# EAGLE design xBeeMSP (EAGLE 9.2.2)
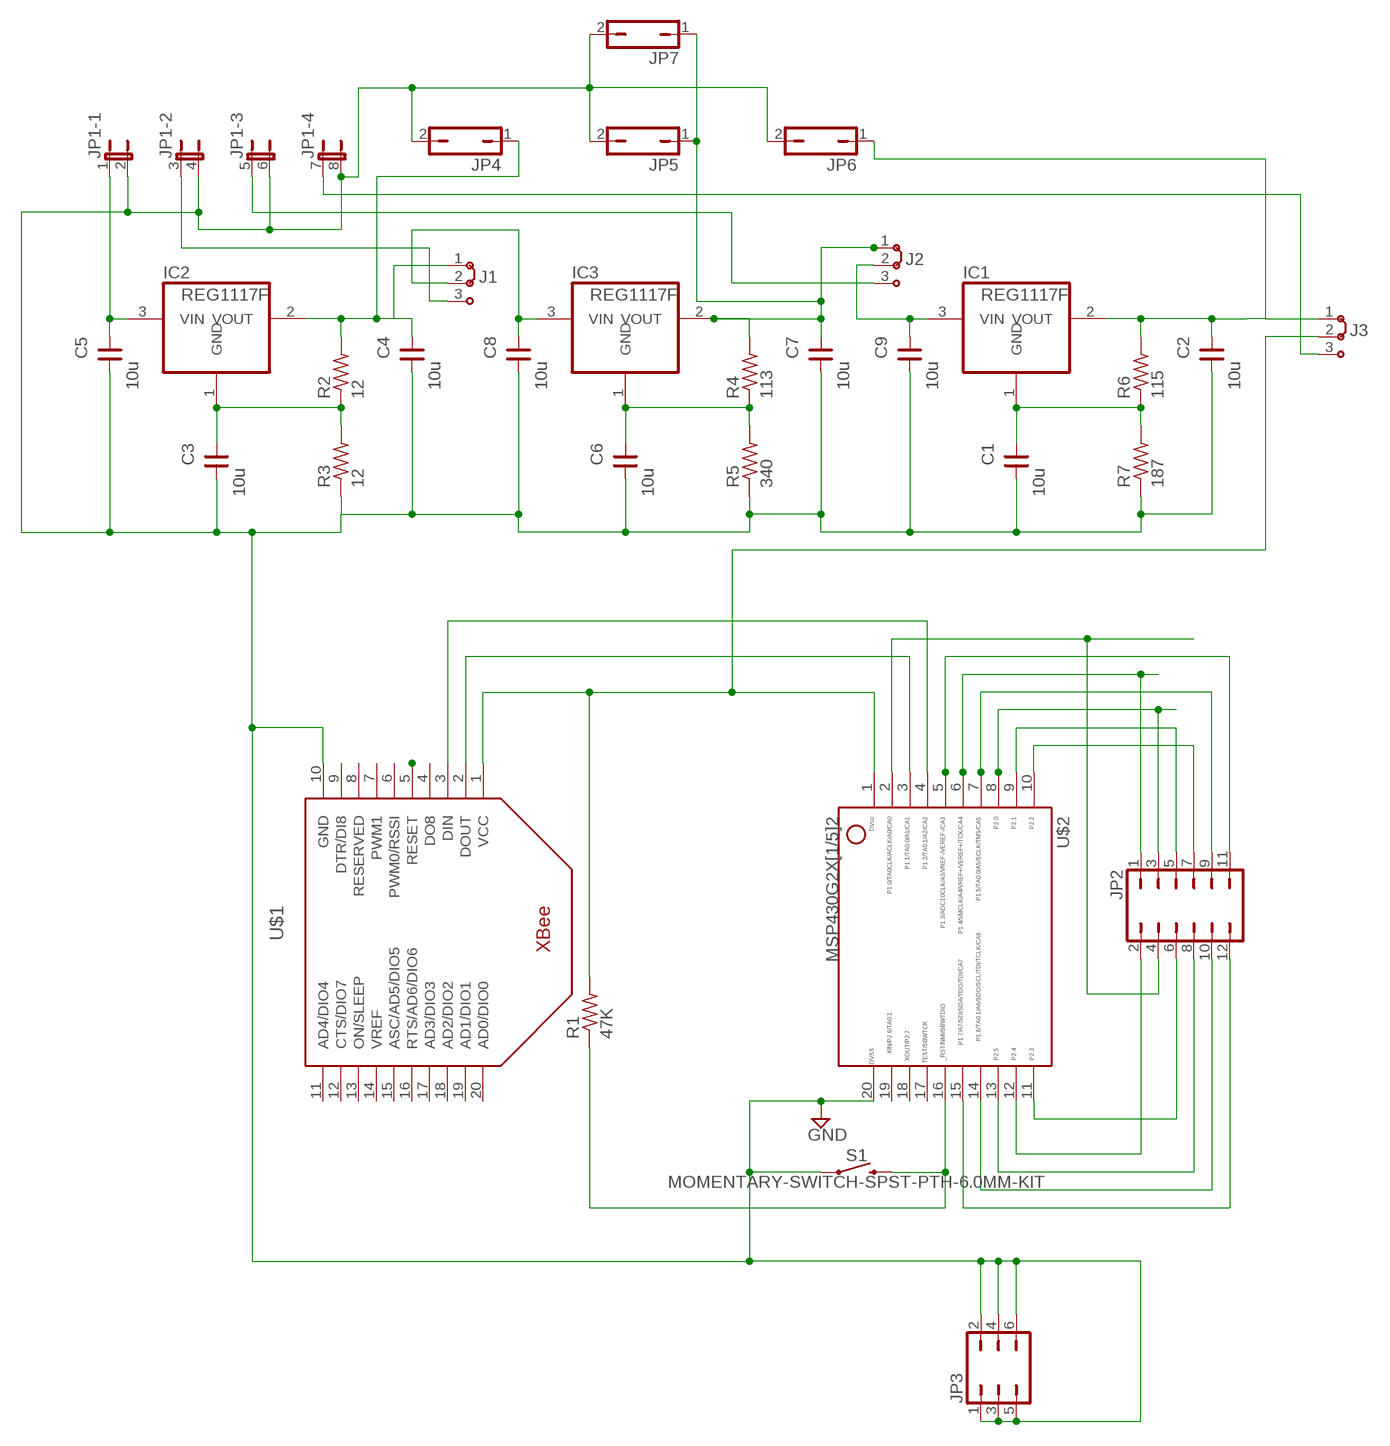
[diagram p0: schematic, sheet 1]

## Parts
C1  10u  CNP-C020-035X018  [C020-035X018]
C2  10u  CNP-C020-035X018  [C020-035X018]
C3  10u  CNP-C020-035X018  [C020-035X018]
C4  10u  CNP-C020-035X018  [C020-035X018]
C5  10u  CNP-C020-035X018  [C020-035X018]
C6  10u  CNP-C020-035X018  [C020-035X018]
C7  10u  CNP-C020-035X018  [C020-035X018]
C8  10u  CNP-C020-035X018  [C020-035X018]
C9  10u  CNP-C020-035X018  [C020-035X018]
IC1  REG1117F  [DD-3]
IC2  REG1117F  [DD-3]
IC3  REG1117F  [DD-3]
J1  J2X2MM  [04C]
J2  J2X2MM  [04C]
J3  J2X2MM  [04C]
JP1  JP4QE  [JP4Q]
JP2  JP6Q  [JP6Q]
JP3  JP3Q  [JP3Q]
JP4  JP1Q  [JP1]
JP5  JP1Q  [JP1]
JP6  JP1Q  [JP1]
JP7  JP1Q  [JP1]
R1  47K  R-US_0207/10  [0207/10]
R2  12  R-US_0207/10  [0207/10]
R3  12  R-US_0207/10  [0207/10]
R4  113  R-US_0207/10  [0207/10]
R5  340  R-US_0207/10  [0207/10]
R6  115  R-US_0207/10  [0207/10]
R7  187  R-US_0207/10  [0207/10]
S1  MOMENTARY-SWITCH-SPST-PTH-6.0MM-KIT  [TACTILE_SWITCH_PTH_6.0MM_KIT]
U$1  XBEE  [XBEE]
U$2  G2X[1/5]2---N20  [N20]

## Nets
3.3VOUT: C2.2 IC1.2(VOUT) J3.1 JP6.1 R6.2
5VIN: C9.2 IC1.3(VIN) J2.2
5VOUT: C7.2 IC3.2(VOUT) J2.1 JP5.1 JP7.1 R4.2
12VIN: C8.2 IC3.3(VIN) J1.2
12VOUT: C4.2 IC2.2(VOUT) J1.1 JP4.1 R2.2
BACKUP-5VIN: J2.3 JP1.5
BACKUP-12VIN: J1.3 JP1.3
BACKUP-VCC: J3.3 JP1.7
GND: C1.1 C2.1 C3.1 C4.1 C5.1 C6.1 C7.1 C8.1 C9.1 JP1.2 JP1.4 JP1.6 JP1.8 JP3.1 JP3.2 JP3.3 JP3.4 JP3.5 JP3.6 JP4.2 JP5.2 JP6.2 JP7.2 R3.1 R5.1 R7.1 S1.1 U$1.5(RESET) U$1.10(GND) U$2.20
N$1: U$1.2(DOUT) U$2.3
N$2: U$1.3(DIN) U$2.4
N$3: JP2.4 U$2.2
N$4: R1.1 S1.3 U$2.16
N$5: JP2.9 U$2.7
N$6: JP2.3 U$2.8
N$7: JP2.12 U$2.15
N$8: JP2.11 U$2.5
N$9: JP2.5 U$2.9
N$10: JP2.1 U$2.6
N$11: JP2.10 U$2.14
N$12: JP2.7 U$2.10
N$13: JP2.8 U$2.13
N$14: JP2.2 U$2.12
N$16: JP2.6 U$2.11
N$19: C3.2 IC2.1(GND) R2.1 R3.2
N$21: C1.2 IC1.1(GND) R6.1 R7.2
N$23: C6.2 IC3.1(GND) R4.1 R5.2
N$38: C5.2 IC2.3(VIN) JP1.1
VCC: J3.2 R1.2 U$1.1(VCC) U$2.1
Unconnected: U$1.4(DO8) U$1.6(PWM0/RSSI) U$1.7(PWM1) U$1.8(RESERVED) U$1.9(DTR/DI8) U$1.11(AD4/DIO4) U$1.12(CTS/DIO7) U$1.13(ON/SLEEP) U$1.14(VREF) U$1.15(ASC/AD5/DIO5) U$1.16(RTS/AD6/DIO6) U$1.17(AD3/DIO3) U$1.18(AD2/DIO2) U$1.19(AD1/DIO1) U$1.20(AD0/DIO0) U$2.17 U$2.18 U$2.19

## Library data of the parts
C1-C9 = cap-master:CNP-: NON-POLARIZED CAP
IC1-IC3 = burr-brown:REG1117: 800mA and 1A Low Dropout (LDO) Positive Regulator 1.8V, 2.5V, 2.85V, 3.3V, 5V, and Adj; MF: TEXAS INSTRUMENTS; MPN: REG1117FAKTTT; OC_FARNELL: 1296120; OC_NEWARK: 87H2562
J1-J3 = jumper:J2: Jumper switch 2 x 2.5 mm
JP1 = jumper:JP4QE: JUMPER
JP2 = jumper:JP6Q: JUMPER
JP3 = jumper:JP3Q: JUMPER
JP4-JP7 = jumper:JP1Q: JUMPER
R1-R7 = resistor:R-US_: RESISTOR, American symbol
S1 = SparkFun-Switches:MOMENTARY-SWITCH-SPST: Momentary Switch (Pushbutton) - SPST Normally-open (NO) SPST momentary switches (buttons, pushbuttons). Variants PTH-12MM - 12mm square, through-hole Momentary Pushbutton Switch - 12mm Square <https://www.sparkfun.com/products/9190> (COM-09190) PTH-6.0MM, PTH-6.0MM-KIT - 6.0mm square, through-hole Mini Pushbutton Switch <https://www.sparkfun.com/products/97> (COM-00097) KIT package intended for soldering kit's - only one side of pads' copper is exposed. PTH-RIGHT-ANGLE-KIT - Right-angle, through-hole Right Angle Tactile Button <https://www.sparkfun.com/products/10791> - Used on SparkFun BigTime Watch Kit <https://www.sparkfun.com/products/11734> SMD-12MM - 12mm square, surface-mount Tactile Button - SMD (12mm) <https://www.sparkfun.com/products/12993> (COM-12993) Used on SparkFun PicoBoard <https://www.sparkfun.com/products/11888> SMD-4.5MM - 4.5mm Square Trackball Switch Used on SparkFun Blackberry Trackballer Breakout <https://www.sparkfun.com/products/13169> SMD-4.6MMX2.8MM - 4.60mm x 2.80mm, surface mount Used on SparkFun SAMD21 Mini Breakout <https://www.sparkfun.com/products/13664> SMD-5.2MM, SMD-5.2-REDUNDANT - 5.2mm square, surface-mount Mini Pushbutton Switch - SMD <https://www.sparkfun.com/products/8720> (COM-08720) Used on Arduino Pro Mini <https://www.sparkfun.com/products/11114> REDUNDANT package connects both switch circuits together SMD-6.0X3.5MM - 6.0 x 3.5mm, surface mount Momentary Reset Switch SMD <https://www.sparkfun.com/products/8229> (COM-08229) SMD-6.2MM-TALL - 6.2mm square, surface mount Tactile Button - SMD (6mm) <https://www.sparkfun.com/products/12992> Used on SparkFun Digital Sandbox <https://www.sparkfun.com/products/12651> SMD-RIGHT-ANGLE - Right-angle, surface mount Used on SparkFun Block for Intel® Edison - Arduino <https://www.sparkfun.com/products/13036>; PROD_ID: SWCH-08441; SF_SKU: COM-00097
U$1 = adafruit:XBEE
U$2 = TI_MSP430_v16:G2X[1/5]2---N20: MSP430G2X[1/5]2 MSP430G2x52, MSP430G2x12 PDIP (N) 20 Pin Package http://focus.ti.com/docs/prod/folders/print/msp430g2452.html

## Board
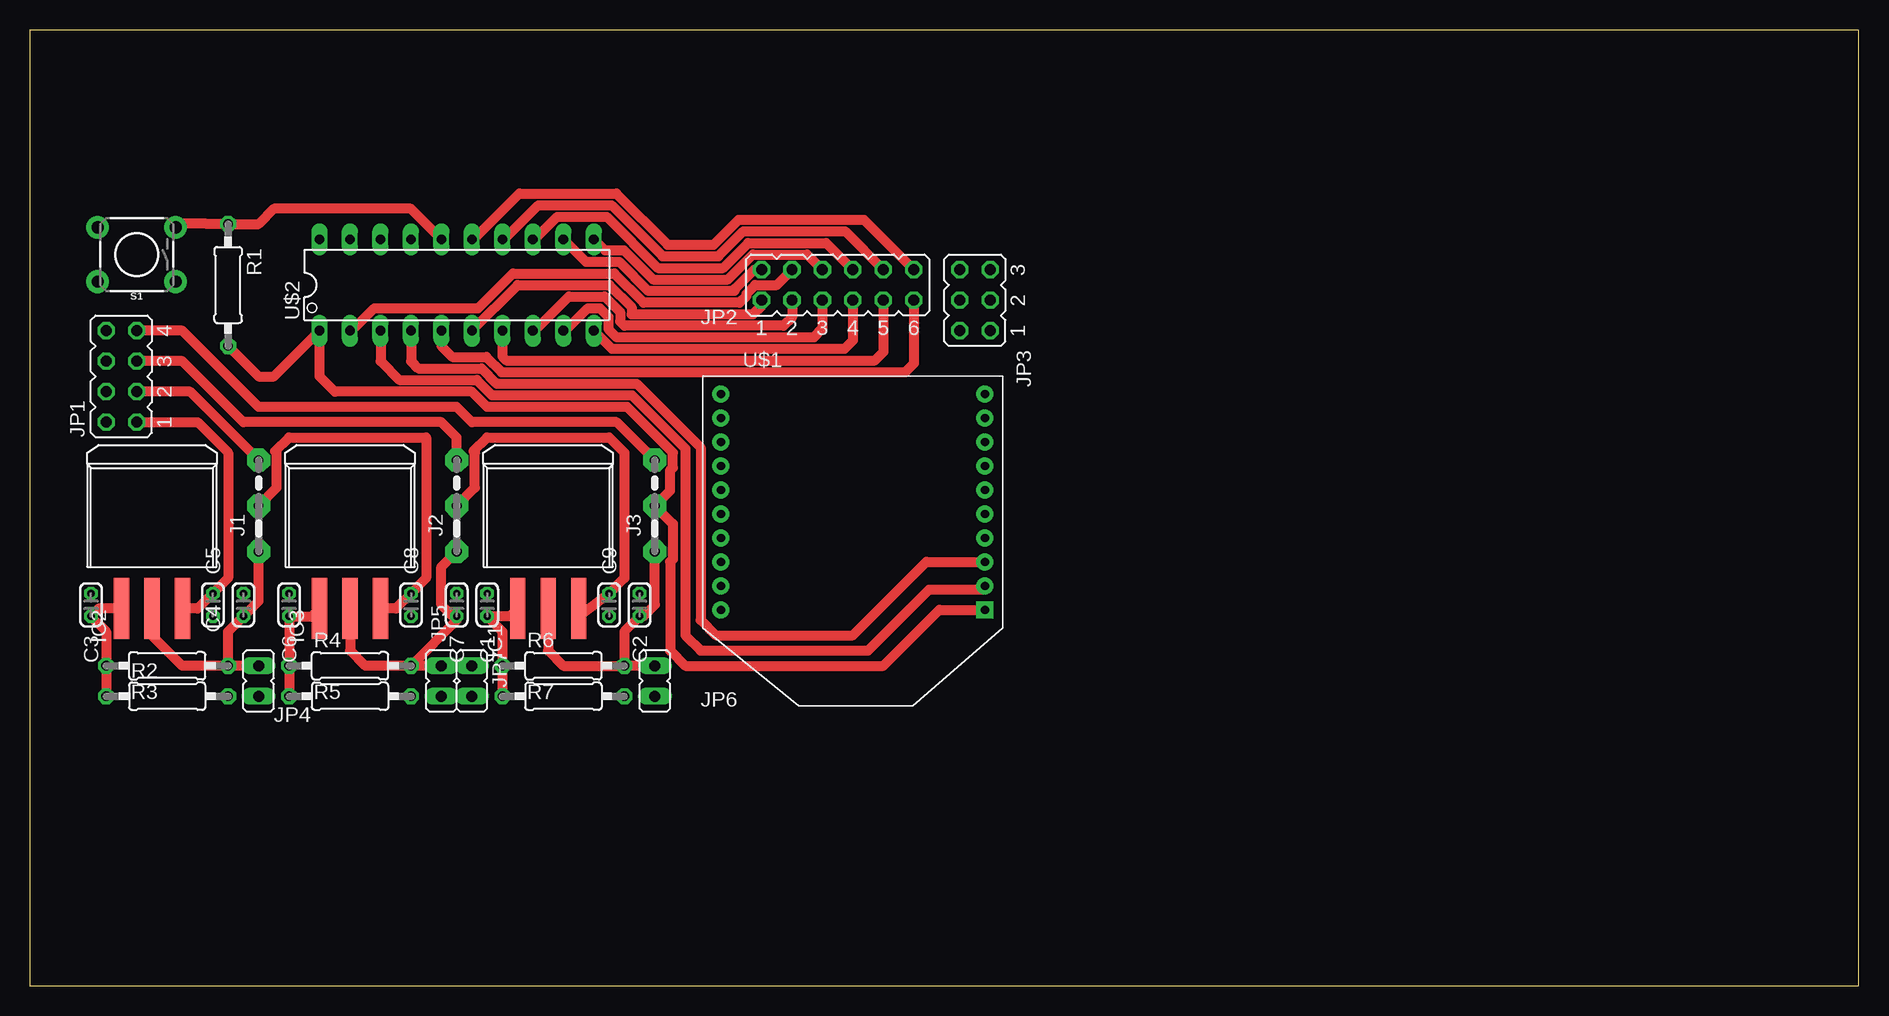
[diagram p1: board, top side]
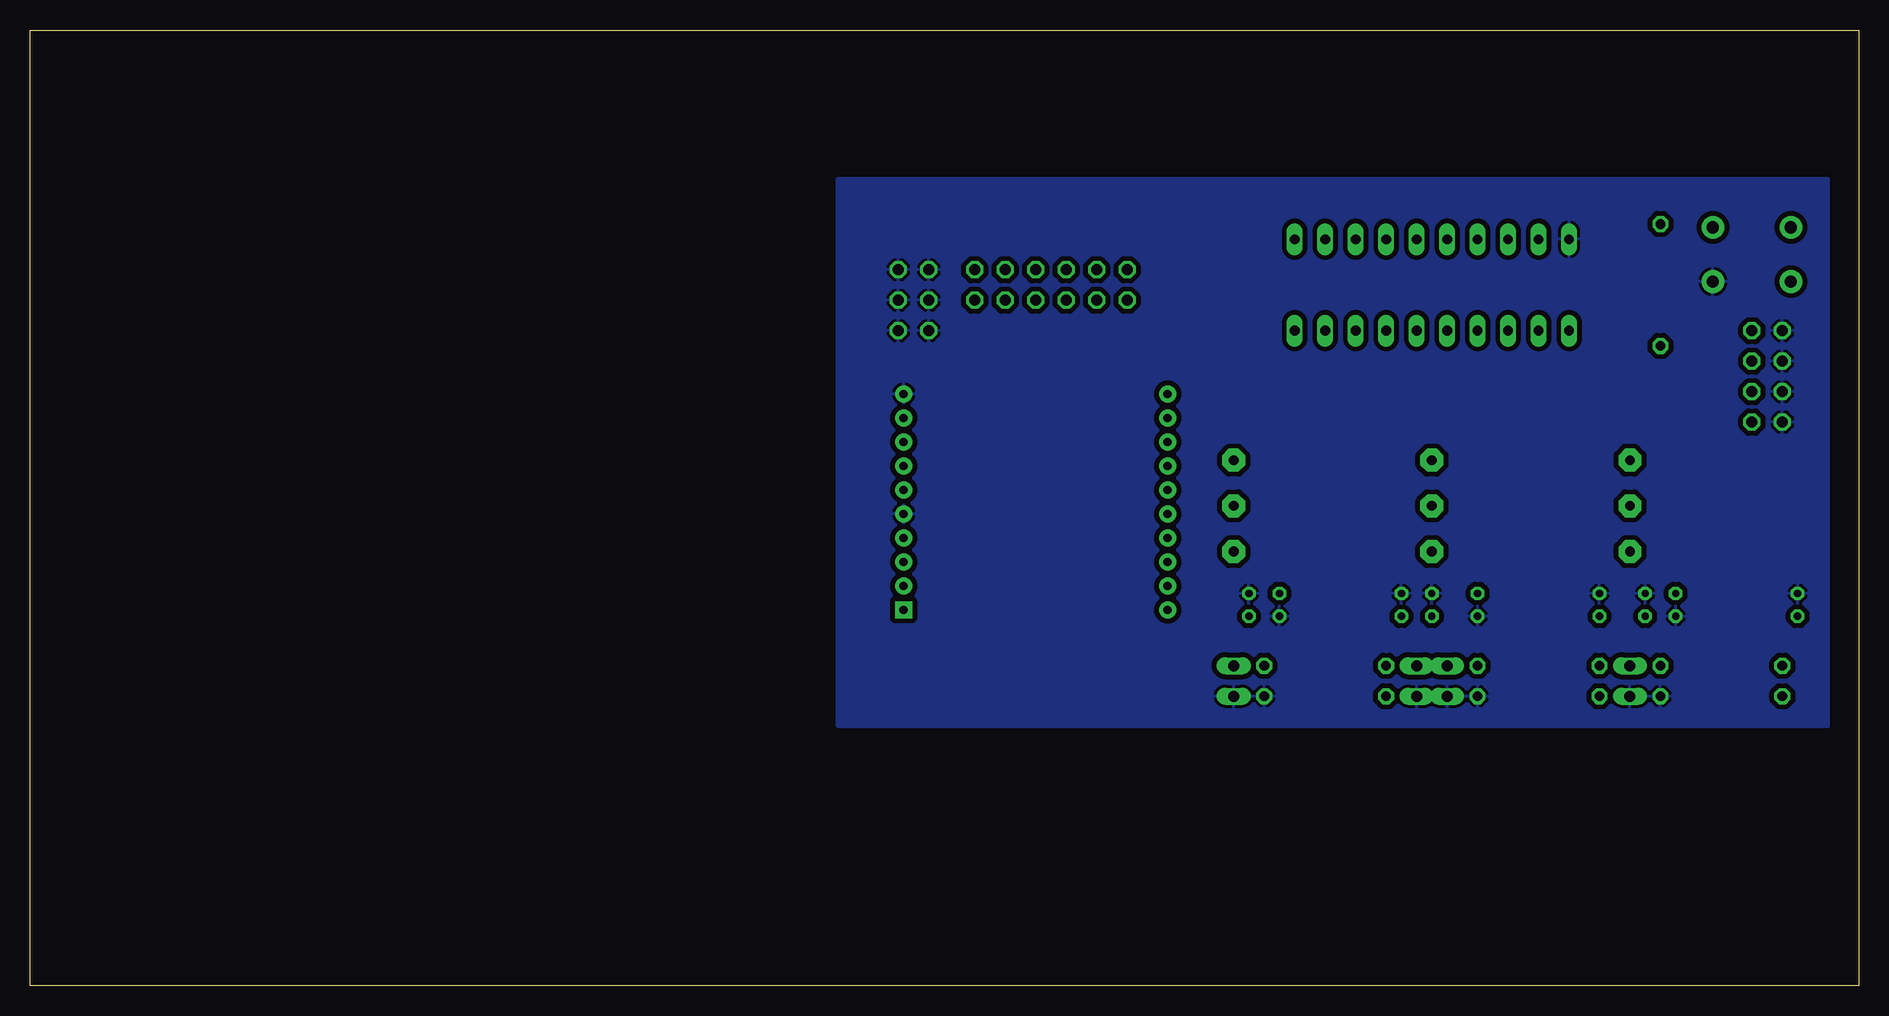
[diagram p2: board, bottom side, seen from below]

Size 152.38 x 79.68 mm. Coordinates in mm from the lower left corner, seen from the top.
Outline: 0,0 152.38,0 152.38,79.68 0,79.68 0,0
Copper layers (1*16): Top 0.035mm / dielectric 1.5mm / Bottom 0.035mm
Design rules "default": minimum track width 6mil, minimum drill 0.35mm, track to track 6mil, track to pad 6mil, pad to pad 6mil, via to via 6mil, smd to smd 6mil, copper to edge 40mil, drill to drill 6mil, minimum pad ring 10mil, minimum via ring 8mil, stop-mask expansion 4mil, vias tented up to drill 0mil, thermal gap 10mil

### Footprints (pad centres in the part's own frame; a part is rotated, then mirrored left to right if it is on the bottom)
C020-035X018 = drill 0.61 pad 1.016 octagon: 1 -0.953,0; 2 0.953,0
DD-3 = smd 1.27 x 5.08: 1 -2.54,-7.938; 2 0,-7.938; 3 2.54,-7.938
04C = drill 0.813 pad 1.905 octagon: 1 -1.905,0; 2 1.905,0; 3 5.715,0
JP4Q = drill 0.914 octagon: 1 -3.81,-1.27; 2 -3.81,1.27; 3 -1.27,-1.27; 4 -1.27,1.27; 5 1.27,-1.27; 6 1.27,1.27; 7 3.81,-1.27; 8 3.81,1.27
JP6Q = drill 0.914 octagon: 1 -6.35,-1.27; 2 -6.35,1.27; 3 -3.81,-1.27; 4 -3.81,1.27; 5 -1.27,-1.27; 6 -1.27,1.27; 7 1.27,-1.27; 8 1.27,1.27; 9 3.81,-1.27; 10 3.81,1.27; 11 6.35,-1.27; 12 6.35,1.27
JP3Q = drill 0.914 octagon: 1 -2.54,-1.27; 2 -2.54,1.27; 3 0,-1.27; 4 0,1.27; 5 2.54,-1.27; 6 2.54,1.27
JP1 = drill 0.914 long: 1 0,-1.27; 2 0,1.27
0207/10 = drill 0.813 octagon: 1 -5.08,0; 2 5.08,0
TACTILE_SWITCH_PTH_6.0MM_KIT = drill 1.016 pad 1.88: 1 -3.251,2.261; 2 3.251,2.261; 3 -3.251,-2.261; 4 3.251,-2.261
XBEE = drill 0.7 pad 1.422 square: 1 -11,5.5 | drill 0.7 pad 1.422: 2 -11,3.5; 3 -11,1.5; 4 -11,-0.5; 5 -11,-2.5; 6 -11,-4.5; 7 -11,-6.5; 8 -11,-8.5; 9 -11,-10.5; 10 -11,-12.5; 11 11,-12.5; 12 11,-10.5; 13 11,-8.5; 14 11,-6.5; 15 11,-4.5; 16 11,-2.5; 17 11,-0.5; 18 11,1.5; 19 11,3.5; 20 11,5.5
N20 = drill 0.813 long: 1 -11.435,-3.81; 2 -8.895,-3.81; 3 -6.355,-3.81; 4 -3.815,-3.81; 5 -1.275,-3.81; 6 1.265,-3.81; 7 3.805,-3.81; 8 6.345,-3.81; 9 8.885,-3.81; 10 11.425,-3.81; 11 11.425,3.81; 12 8.885,3.81; 13 6.345,3.81; 14 3.805,3.81; 15 1.265,3.81; 16 -1.275,3.81; 17 -3.815,3.81; 18 -6.355,3.81; 19 -8.895,3.81; 20 -11.435,3.81

### Placement (x,y rotation side)
C1  38.1,31.75 270 top
C2  50.8,31.75 270 top
C3  5.08,31.75 270 top
C4  17.78,31.75 270 top
C5  15.24,31.75 90 top
C6  21.59,31.75 270 top
C7  35.56,31.75 270 top
C8  31.75,31.75 90 top
C9  48.26,31.75 90 top
IC1  43.18,39.37 0 top
IC2  10.16,39.37 0 top
IC3  26.67,39.37 0 top
J1  19.05,38.1 90 top
J2  35.56,38.1 90 top
J3  52.07,38.1 90 top
JP1  7.62,50.8 90 top
JP2  67.31,58.42 0 top
JP3  78.74,57.15 90 top
JP4  19.05,25.4 180 top
JP5  34.29,25.4 180 top
JP6  52.07,25.4 180 top
JP7  36.83,25.4 180 top
R1  16.51,58.42 270 top
R2  11.43,26.67 0 top
R3  11.43,24.13 180 top
R4  26.67,26.67 0 top
R5  26.67,24.13 180 top
R6  44.45,26.67 0 top
R7  44.45,24.13 180 top
S1  8.89,60.96 180 top
U$1  68.58,36.83 180 top
U$2  35.56,58.42 0 top

### Tracks (layer width: path | path; a pad name or v marks a point on that pad's centre or on a via)
3.3VOUT
  Top 0.813: IC1.2 43.18,27.94 44.45,26.67 R6.2 | R6.2 49.53,29.53 C2.2 51.12,30.8 52.07,31.75 J3.1 | JP6.1 R6.2
5VIN
  Top 0.813: IC1.3 45.72,30.8 C9.2 49.53,33.97 49.53,44.45 48.26,45.72 38.1,45.72 36.95,44.57 37.07,44.44 37.07,41.52 J2.2
5VOUT
  Top 0.813: IC3.2 26.67,27.94 27.94,26.67 R4.2 | R4.2 35.56,30.48 C7.2 35.24,30.8 34.29,31.75 34.29,34.92 J2.1 | R4.2 33.02,26.67 JP5.1 JP7.1
12VIN
  Top 0.813: IC3.3 30.48,31.43 C8.2 33.02,33.97 33.02,45.72 21.59,45.72 20.44,44.57 20.56,44.44 20.56,41.52 J1.2
12VOUT
  Top 0.813: IC2.2 10.16,29.21 12.7,26.67 R2.2 | R2.2 16.51,29.53 C4.2 19.05,32.07 J1.1 | JP4.1 R2.2
BACKUP-5VIN
  Top 0.813: J2.3 35.56,45.72 34.29,46.99 17.78,46.99 12.7,52.07 JP1.5
BACKUP-12VIN
  Top 0.813: J1.3 13.34,49.53 JP1.3
BACKUP-VCC
  Top 0.813: J3.3 48.89,46.99 36.83,46.99 35.56,48.26 19.05,48.26 12.7,54.61 JP1.7
GND
  pour Bottom (isolate 0.406): 2.54,67.31 2.54,21.59 85.09,21.59 85.09,67.31
N$1
  Top 0.813: U$1.2 79.27,33.02 74.93,33.02 69.85,27.94 55.88,27.94 54.61,29.21 54.61,44.78 50.16,49.22 38.5,49.22 37.23,50.5 30.79,50.5 29.21,52.07 U$2.3
N$2
  Top 0.813: U$1.3 74.7,35.33 68.58,29.21 57.15,29.21 55.88,30.48 55.88,44.87 50.56,50.19 38.9,50.19 38.83,50.26 37.63,51.46 32.36,51.46 31.75,52.07 U$2.4
N$3
  Top 0.813: U$2.2 26.82,54.61 28.7,56.49 37.34,56.49 40.23,59.39 48.69,59.39 51.13,56.95 59.12,56.95 59.69,57.51 59.69,57.68 60.43,58.42 62.23,58.42 JP2.4
N$4
  Top 0.813: U$2.16 31.74,64.77 20.32,64.77 19.05,63.5 R1.1 14.71,63.5 14.7,63.52 12.44,63.52 S1.3
N$5
  Top 0.813: U$2.7 39.37,52.45 39.7,52.12 70.41,52.12 71.12,52.83 JP2.9
N$6
  Top 0.813: U$2.8 42.06,54.61 44.91,57.45 47.89,57.45 49.17,56.17 49.17,55.38 49.53,55.02 62.79,55.02 63.5,55.73 JP2.3
N$7
  Top 0.813: U$2.15 36.98,62.23 40.79,66.04 48.86,66.04 53.13,61.77 56.96,61.77 59.05,63.86 69.49,63.86 JP2.12
N$8
  Top 0.813: U$2.5 34.29,53.34 35.2,52.43 38.03,52.43 39.3,51.16 72.95,51.16 73.66,51.87 JP2.11
N$9
  Top 0.813: U$2.9 44.6,54.61 46.48,56.49 47.49,56.49 48.2,55.78 48.2,54.76 48.91,54.05 65.33,54.05 66.04,54.77 JP2.5
N$10
  Top 0.813: U$2.6 40.63,58.42 48.29,58.42 50.13,56.58 50.13,55.98 60.25,55.98 60.96,56.7 JP2.1
N$11
  Top 0.813: U$2.14 39.52,62.23 42.37,65.08 48.46,65.08 52.73,60.81 57.36,60.81 59.44,62.89 67.92,62.89 JP2.10
N$12
  Top 0.813: U$2.10 48.51,53.09 67.87,53.09 68.58,53.8 JP2.7
N$13
  Top 0.813: U$2.13 42.06,62.23 43.94,64.11 48.06,64.11 52.33,59.84 57.76,59.84 59.84,61.92 66.34,61.92 JP2.8
N$14
  Top 0.813: U$2.12 46.32,60.35 49.09,60.35 51.53,57.91 58.73,57.91 58.73,58.08 60.34,59.69 JP2.2
N$16
  Top 0.813: U$2.11 47.9,61.32 49.49,61.32 51.93,58.88 58.16,58.88 60.24,60.96 64.77,60.96 JP2.6
N$19
  Top 0.152: 7.3,31.43 IC2.1
  Top 0.813: R3.2 R2.1 6.35,29.53 C3.2 5.71,31.43 IC2.1
N$21
  Top 0.813: IC1.1 40.01,30.8 C1.2 39.37,29.53 R6.1 R7.2
N$23
  Top 0.813: R5.2 R4.1 C6.2 23.5,30.8 IC3.1
N$38
  Top 0.813: IC2.3 13.97,31.43 C5.2 16.51,33.97 16.51,44.45 13.97,46.99 JP1.1
VCC
  Top 0.813: U$1.1 75.78,31.33 71.12,26.67 54.61,26.67 53.34,27.94 53.34,35.33 53.58,35.57 53.58,38.49 J3.2 53.34,41.27 53.34,42.95 53.58,43.19 53.58,44.44 49.76,48.26 38.1,48.26 36.83,49.53 25.4,49.53 24.12,50.8 U$2.1 20.32,50.8 19.05,50.8 R1.2